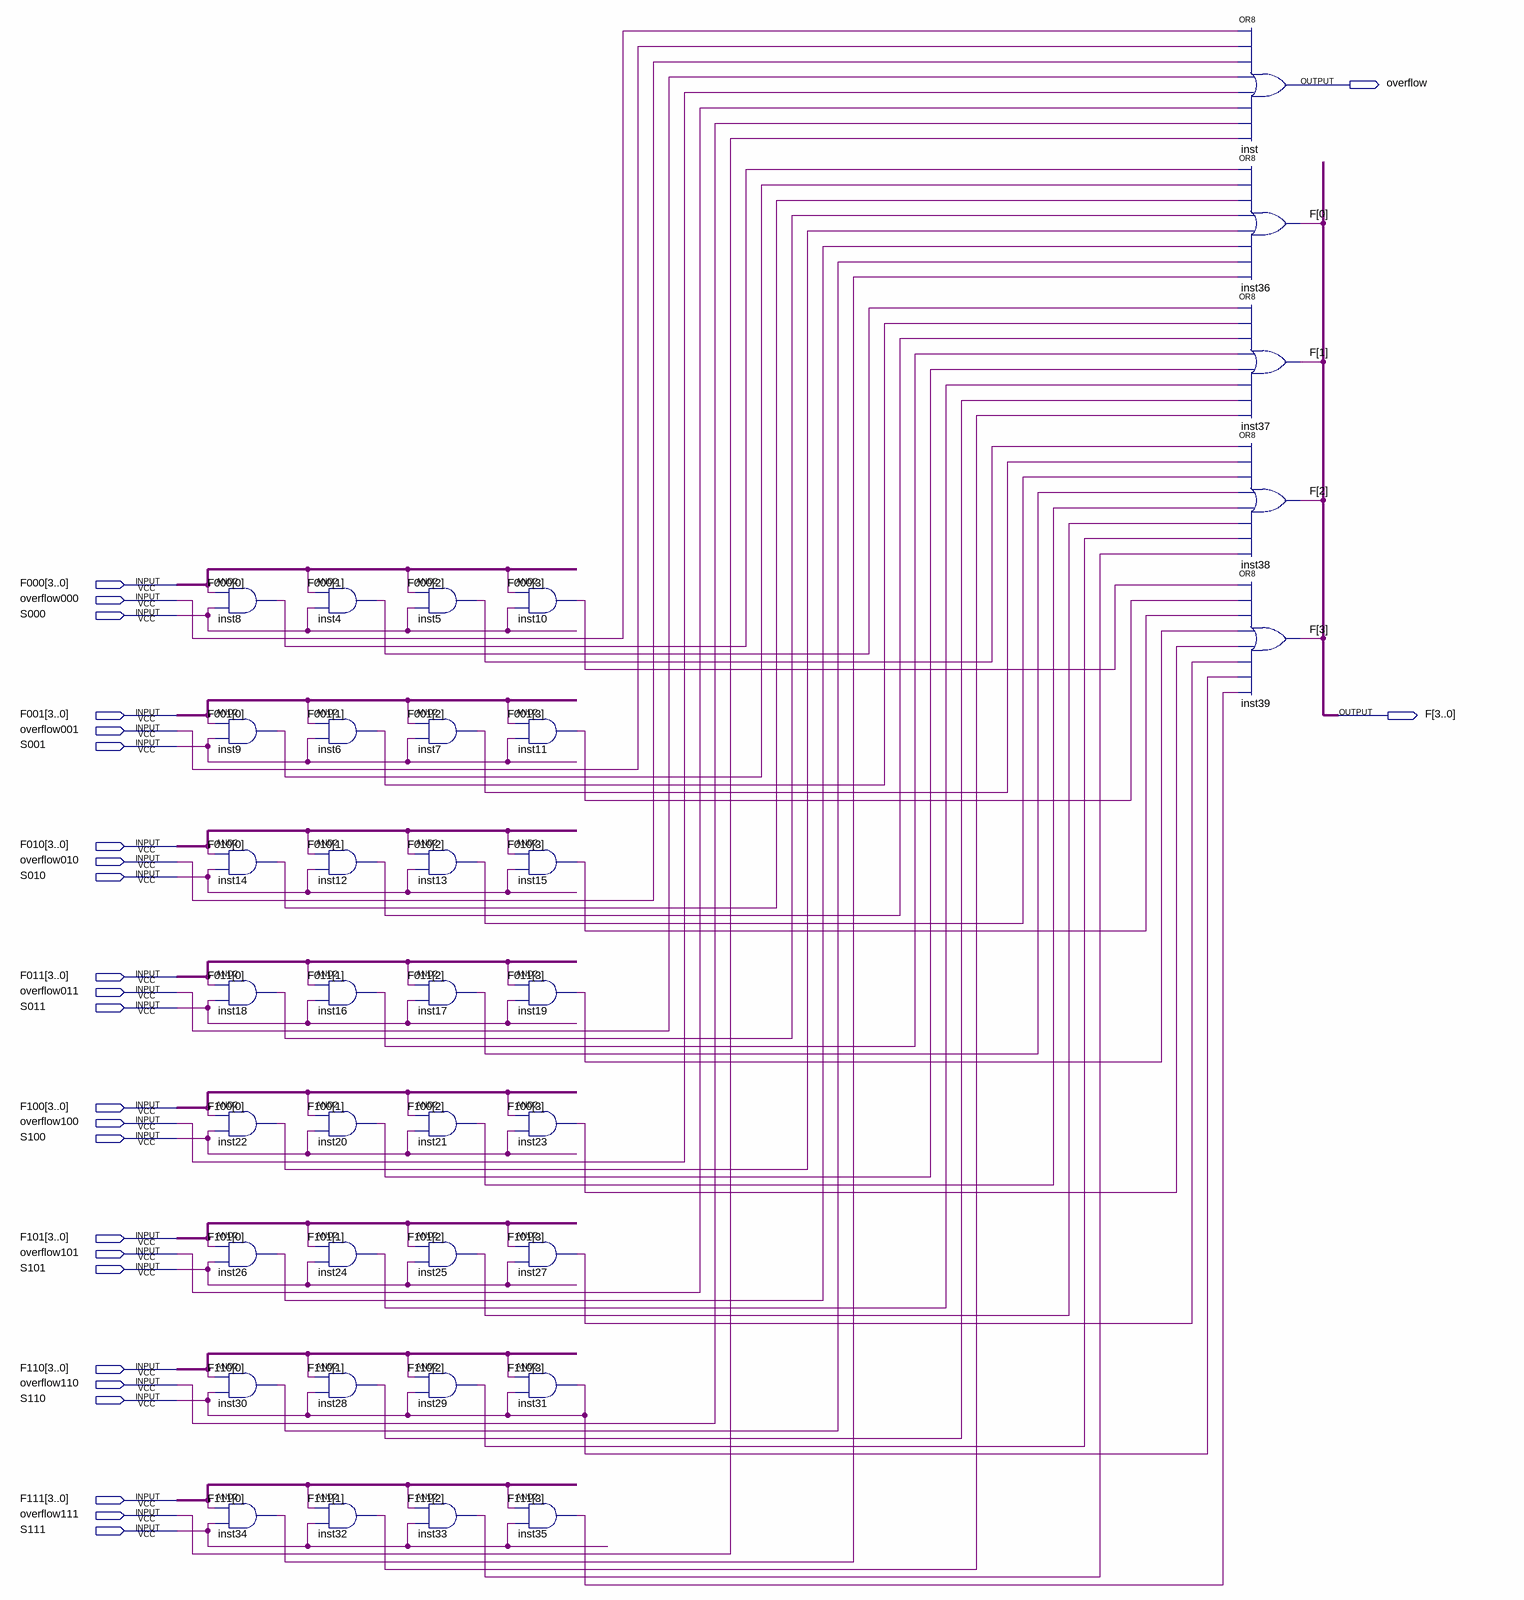
[diagram p0: schematic sheet]
// Quartus schematic MUX.bdf as structural Verilog: 37 symbols, 26 pins
module MUX (
  input  [3:0] F000,
  input  overflow000,
  input  S000,
  input  [3:0] F001,
  input  overflow001,
  input  S001,
  input  [3:0] F010,
  input  overflow010,
  input  S010,
  input  [3:0] F011,
  input  overflow011,
  input  S011,
  input  [3:0] F100,
  input  overflow100,
  input  S100,
  input  [3:0] F101,
  input  overflow101,
  input  S101,
  input  [3:0] F110,
  input  overflow110,
  input  S110,
  input  [3:0] F111,
  input  overflow111,
  input  S111,
  output overflow,
  output [3:0] F
);

  wire inst4_out, inst5_out, inst6_out, inst7_out, inst8_out, inst9_out, inst10_out, inst11_out, inst12_out,
       inst13_out, inst14_out, inst15_out, inst16_out, inst17_out, inst18_out, inst19_out, inst20_out,
       inst21_out, inst22_out, inst23_out, inst24_out, inst25_out, inst26_out, inst27_out, inst28_out,
       inst29_out, inst30_out, inst32_out, inst33_out, inst34_out, inst35_out;

  and inst8 (inst8_out, F000[0], S000);
  and inst9 (inst9_out, F001[0], S001);
  and inst14 (inst14_out, F010[0], S010);
  and inst18 (inst18_out, F011[0], S011);
  and inst22 (inst22_out, F100[0], S100);
  and inst26 (inst26_out, F101[0], S101);
  and inst30 (inst30_out, F110[0], S110);
  and inst34 (inst34_out, F111[0], S111);
  and inst4 (inst4_out, F000[1], S000);
  and inst6 (inst6_out, F001[1], S001);
  and inst12 (inst12_out, F010[1], S010);
  and inst16 (inst16_out, F011[1], S011);
  and inst20 (inst20_out, F100[1], S100);
  and inst24 (inst24_out, F101[1], S101);
  and inst28 (inst28_out, F110[1], S110);
  and inst32 (inst32_out, F111[1], S111);
  and inst5 (inst5_out, F000[2], S000);
  and inst7 (inst7_out, F001[2], S001);
  and inst13 (inst13_out, F010[2], S010);
  and inst17 (inst17_out, F011[2], S011);
  and inst21 (inst21_out, F100[2], S100);
  and inst25 (inst25_out, F101[2], S101);
  and inst29 (inst29_out, F110[2], S110);
  and inst33 (inst33_out, F111[2], S111);
  and inst10 (inst10_out, F000[3], S000);
  and inst11 (inst11_out, F001[3], S001);
  and inst15 (inst15_out, F010[3], S010);
  and inst19 (inst19_out, F011[3], S011);
  and inst23 (inst23_out, F100[3], S100);
  and inst27 (inst27_out, F101[3], S101);
  and inst31 (S110, F110[3], S110);
  and inst35 (inst35_out, F111[3], S111);
  or inst (overflow, overflow000, overflow001, overflow010, overflow011, overflow100, overflow101, overflow110, overflow111);
  or inst36 (F[0], inst8_out, inst9_out, inst14_out, inst18_out, inst22_out, inst26_out, inst30_out, inst34_out);
  or inst37 (F[1], inst4_out, inst6_out, inst12_out, inst16_out, inst20_out, inst24_out, inst28_out, inst32_out);
  or inst38 (F[2], inst5_out, inst7_out, inst13_out, inst17_out, inst21_out, inst25_out, inst29_out, inst33_out);
  or inst39 (F[3], inst10_out, inst11_out, inst15_out, inst19_out, inst23_out, inst27_out, S110, inst35_out);
endmodule
